# Altium project PCB_Project_2.PrjPcb
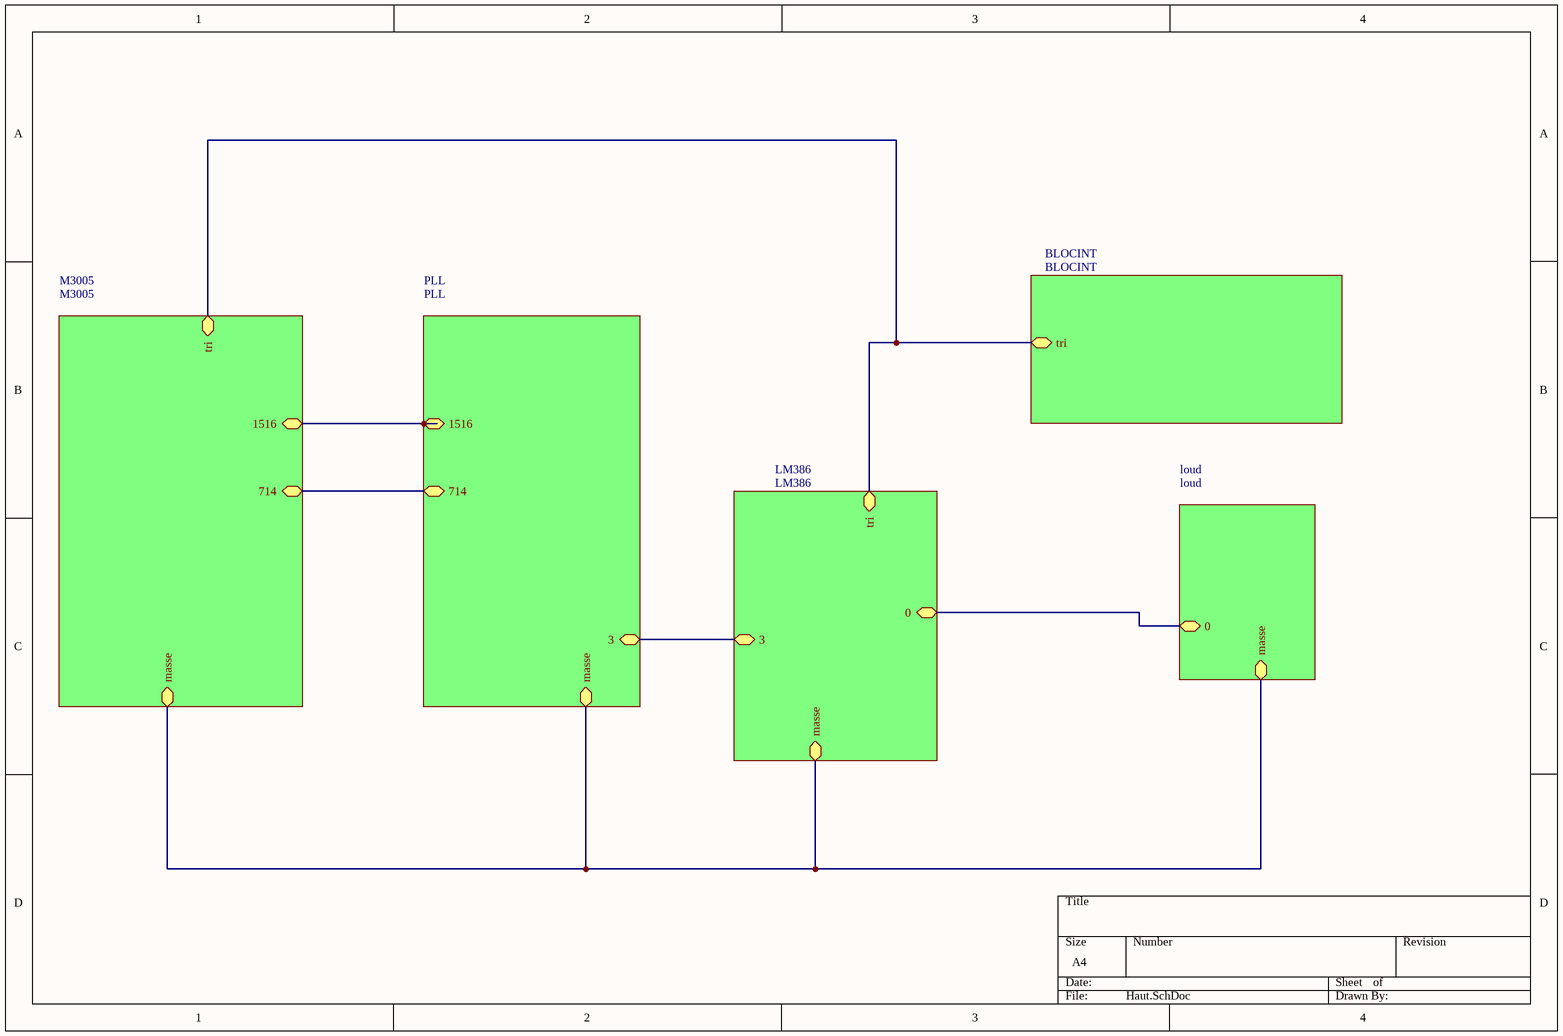
[diagram p0: Haut.SchDoc]
6 sheets, 37 parts. Net scope: hierarchical (ports join the sheet entries above them; power ports are global).
Board files: PCB2.PcbDoc, PCB1.PcbDoc
Sheets:
  Haut.SchDoc
    PLL = PLL.SchDoc
    BLOCINT = BLOCINT.SchDoc
    LM386 = LM386.SchDoc
    loud = loud.SchDoc
    M3005 = M3005.SchDoc

## Sheet Haut.SchDoc
size A4

### Sub-sheets
BLOCINT = BLOCINT: tri
LM386 = LM386: tri, 3, masse, 0
loud = loud: 0, masse
M3005 = M3005: 1516, 714, masse, tri
PLL = PLL: 3, masse, 714, 1516

### Nets
GND: sheet PLL/masse, sheet LM386/masse, sheet loud/masse, sheet M3005/masse
NetC1_1: sheet BLOCINT/tri, sheet LM386/tri, sheet M3005/tri
NetC16_1: sheet PLL/3, sheet LM386/3
NetC19_1: sheet PLL/1516, sheet M3005/1516
NetC20_2: sheet PLL/714, sheet M3005/714
NetLS1_1: sheet LM386/0, sheet loud/0

## Sheet PLL.SchDoc
size A4
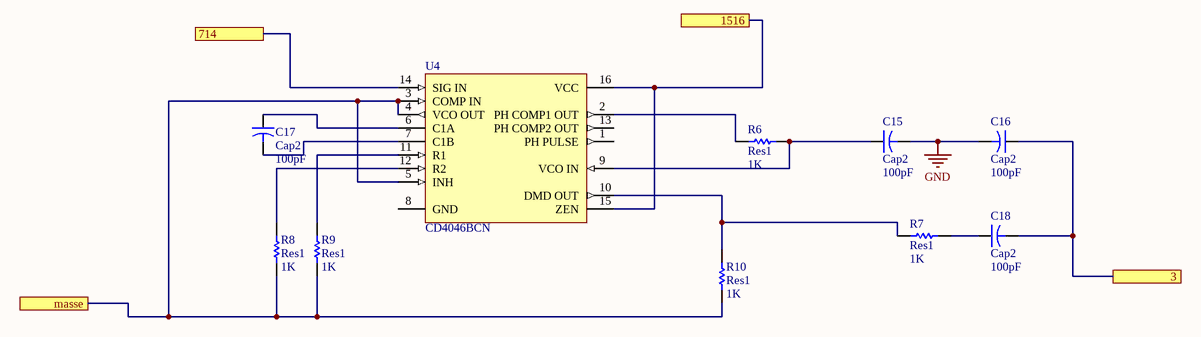
[diagram p1: PLL.SchDoc]

### Parts
C15  Cap2  value 100pF  [RB7.6-15]
C16  Cap2  value 100pF  [RB7.6-15]
C17  Cap2  value 100pF  [RB7.6-15]
C18  Cap2  value 100pF  [RB7.6-15]
R6  Res1  value 1K  [AXIAL-0.3]
R7  Res1  value 1K  [AXIAL-0.3]
R8  Res1  value 1K  [AXIAL-0.3]
R9  Res1  value 1K  [AXIAL-0.3]
R10  Res1  value 1K  [AXIAL-0.3]
U4  CD4046BCN  [N16E]

### Ports
3, 714, 1516, masse

### Nets
GND: C15.2 C16.2 R8.1 R9.1 R10.1 U4.3(COMP_IN) U4.4(VCO_OUT) U4.5(INH) ; port masse
NetC15_1: C15.1 R6.2 U4.9(VCO_IN)
NetC16_1: C16.1 C18.2 ; port 3
NetC17_1: C17.1 U4.6(C1A)
NetC17_2: C17.2 U4.7(C1B)
NetC18_1: C18.1 R7.2
NetC19_1: U4.15(ZEN) U4.16(VCC) ; port 1516
NetC20_2: U4.14(SIG_IN) ; port 714
NetR6_1: R6.1 U4.2(PH_COMP1_OUT)
NetR7_1: R7.1 R10.2 U4.10(DMD_OUT)
NetR8_2: R8.2 U4.12(R2)
NetR9_2: R9.2 U4.11(R1)

Not connected (* = marked no-connect by the designer): U4 1(PH_PULSE) 8(GND) 13(PH_COMP2_OUT)

### Library data of the parts
C15-C18 = Cap2: Capacitor; Published: 23-Sep-2002; PackageReference: CAPR5-4X5; Publisher: Altium Limited; PackageDescription: Capacitor; 2 Leads
R6-R10 = Res1: Resistor; Published: 8-Jun-2000; LatestRevisionDate: 17-Jul-2002; LatestRevisionNote: Re-released for DXP Platform.; PackageReference: AXIAL-0.3; Publisher: Altium Limited; PackageDescription: Axial Device, Thru-Hole; 2 Leads; 0.3 in Pin Spacing
U4 = CD4046BCN: Micropower Phase-Locked Loop; Published: 17-Jul-2002; LatestRevisionDate: 04-Mar-2005; LatestRevisionNote: Stylized 3D Model Added.; DatasheetVersion: Jan-1999; PackageVersion: 2000; PackageReference: N16E; Publisher: Altium Limited; PackageDescription: DIP, 16-Pin, Row Spacing 7.62 mm, Pitch 2.54 mm; ComponentLink1Description: Manufacturer Link; ComponentLink1URL: http://www.fairchildsemi.com/; ComponentLink2Description: Datasheet; ComponentLink2URL: http://www.fairchildsemi.com/ds/CD%2FCD4046BC.pdf

## Sheet BLOCINT.SchDoc
size A4
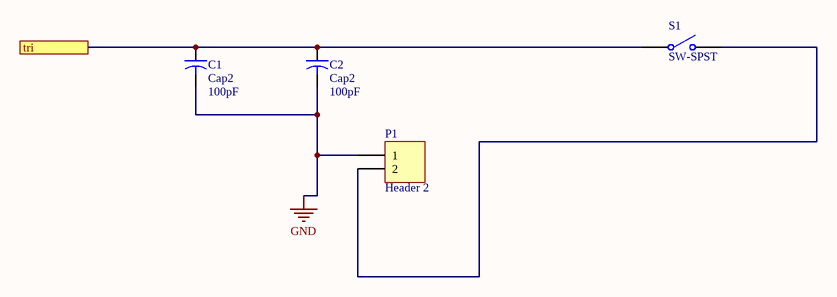
[diagram p2: BLOCINT.SchDoc]

### Parts
C1  Cap2  value 100pF  [RB7.6-15]
C2  Cap2  value 100pF  [RB7.6-15]
P1  Header 2  [HDR1X2]
S1  SW-SPST  [SPST-2]

### Ports
tri

### Nets
GND: C1.2 C2.2 P1.1
NetC1_1: C1.1 C2.1 S1.1(COMMON) ; port tri
NetP1_2: P1.2 S1.2(NO)

### Library data of the parts
C1 C2 = Cap2: Capacitor; Published: 23-Sep-2002; PackageReference: CAPR5-4X5; Publisher: Altium Limited; PackageDescription: Capacitor; 2 Leads
P1 = Header 2: Header, 2-Pin; LatestRevisionDate: 17-Jul-2002; LatestRevisionNote: Re-released for DXP Platform.; Publisher: Altium Limited
S1 = SW-SPST: Single-Pole, Single-Throw Switch; Published: 24-Mar-1999; LatestRevisionDate: 17-Jul-2002; LatestRevisionNote: Re-released for DXP Platform.; PackageReference: SPST-2; Publisher: Altium Limited; PackageDescription: Switch; 2 Leads

## Sheet LM386.SchDoc
size A4
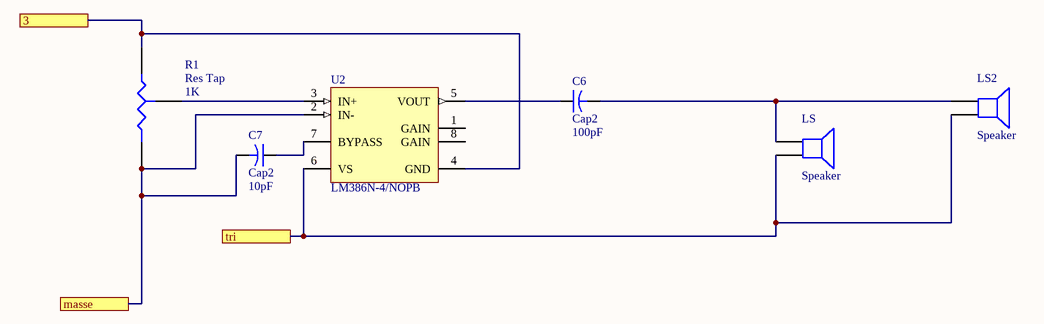
[diagram p3: LM386.SchDoc]

### Parts
(Parts that share a designator on the sheet are numbered #1, #2 ... from top to bottom, then left to right.)
C6  Cap2  value 100pF  [RB7.6-15]
C7  Cap2  value 10pF  [RB7.6-15]
LS  Speaker  [PIN2]
LS2#1  Speaker  [PIN2]
R1  Res Tap  value 1K  [VR3]
U2  LM386N-4/NOPB  [N08E]

### Ports
3, masse, tri

### Nets
GND: C7.2 R1.2(B) U2.2(IN-) ; port masse
NetC1_1: LS.2 LS2#1.2 U2.6(VS) ; port tri
NetC6_1: C6.1 U2.5(VOUT)
NetC6_2: C6.2 LS.1 LS2#1.1
NetC7_1: C7.1 U2.7(BYPASS)
NetC16_1: R1.1(A) U2.4(GND) ; port 3
NetR1_3: R1.3(TAP) U2.3(IN+)

Not connected (* = marked no-connect by the designer): U2 1(GAIN) 8(GAIN)

### Library data of the parts
C6 C7 = Cap2: Capacitor; Published: 23-Sep-2002; PackageReference: CAPR5-4X5; Publisher: Altium Limited; PackageDescription: Capacitor; 2 Leads
LS LS2#1 = Speaker: Loudspeaker; Published: 24-Mar-1999; LatestRevisionDate: 17-Jul-2002; LatestRevisionNote: Re-released for DXP Platform.; PackageReference: PIN2; Publisher: Altium Limited
R1 = Res Tap: Tapped Resistor; Sim Note: Enter the Resistance value and the set point into parameter fields.; Set Position: 0.5; Published: 24-Mar-1999; LatestRevisionDate: 17-Jul-2002; LatestRevisionNote: Re-released for DXP Platform.; PackageReference: VR3; Publisher: Altium Limited; PackageDescription: Variable Resistor, Thru-Hole; 3 Leads
U2 = LM386N-4/NOPB: Low Voltage Audio Power Amplifier, 8-pin MDIP, Pb-Free; Manufacturer: National Semiconductor; PackageTopMarking: NSUZXYTTE#*LM*386N-4; PowerWise: N; CompType: Audio IC; Published: 1-Mar-2010; DatasheetVersion: Aug-2000; PackageVersion: revG, May-2006; PackageReference: N08E; Publisher: Altium Limited; PackageDescription: MDIP, .365 x .250 x .130in, 8 Lead, .100in Pitch; Supplier 1: Digi-Key; Supplier Part Number 1: LM386N-4-ND; Supplier 2: Farnell; Supplier Part Number 2: 1184987; PartNumber: LM386N-4/NOPB; RoHS: Y; PinCount: 8; Code_JEDEC: MS-001-BA; ComponentLink1Description: LM386 Datasheet; ComponentLink1URL: http://www.national.com/ds/LM/LM386.pdf; ComponentLink2Description: LM386 Web Page; ComponentLink2URL: http://www.national.com/pf/LM/LM386.html; ComponentLink3Description: N08E Package Page; ComponentLink3URL: http://www.national.com/packaging/folders/n08e.html

## Sheet loud.SchDoc
size A4
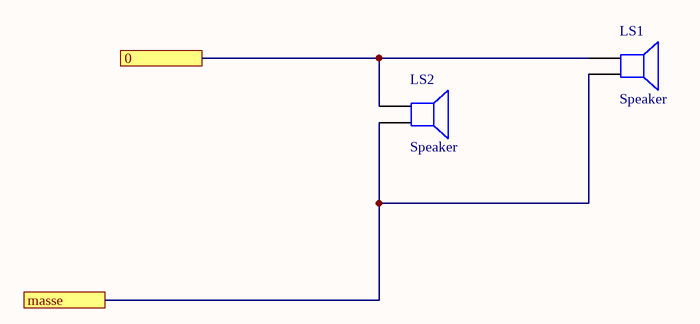
[diagram p4: loud.SchDoc]

### Parts
(Parts that share a designator on the sheet are numbered #1, #2 ... from top to bottom, then left to right.)
LS1  Speaker  [PIN2]
LS2#2  Speaker  [PIN2]

### Ports
0, masse

### Nets
GND: LS1.2 LS2#2.2 ; port masse
NetLS1_1: LS1.1 LS2#2.1 ; port 0

### Library data of the parts
LS1 LS2#2 = Speaker: Loudspeaker; Published: 24-Mar-1999; LatestRevisionDate: 17-Jul-2002; LatestRevisionNote: Re-released for DXP Platform.; PackageReference: PIN2; Publisher: Altium Limited

## Sheet M3005.SchDoc
size A4
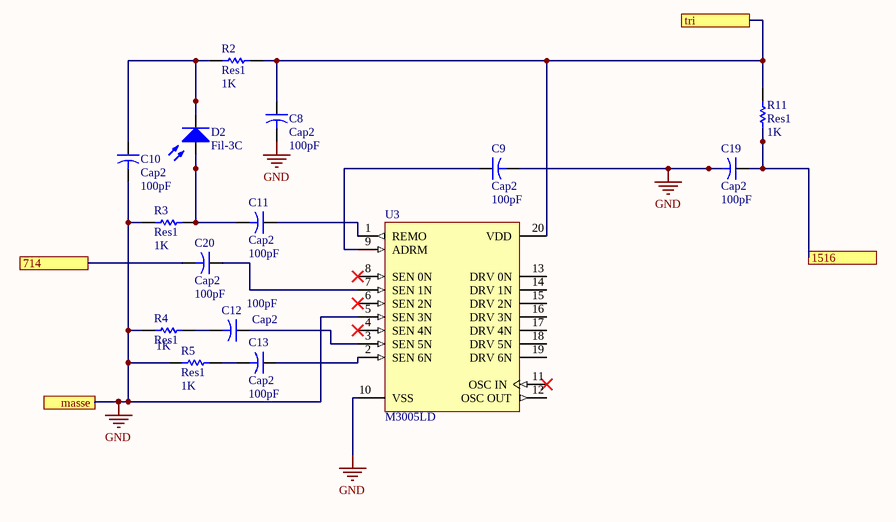
[diagram p5: M3005.SchDoc]

### Parts
C8  Cap2  value 100pF  [RAD-0.2]
C9  Cap2  value 100pF  [RAD-0.2]
C10  Cap2  value 100pF  [RAD-0.2]
C11  Cap2  value 100pF  [RAD-0.2]
C12  Cap2  value 100pF  [RAD-0.2]
C13  Cap2  value 100pF  [RAD-0.2]
C19  Cap2  value 100pF  [RAD-0.2]
C20  Cap2  value 100pF  [RAD-0.2]
D2  Fil-3C  [PIN2]
R2  Res1  value 1K  [AXIAL-0.3]
R3  Res1  value 1K  [AXIAL-0.3]
R4  Res1  value 1K  [AXIAL-0.3]
R5  Res1  value 1K  [AXIAL-0.3]
R11  Res1  value 1K  [AXIAL-0.3]
U3  M3005LD  [SO20_N]

### Ports
714, 1516, masse, tri

### Nets
GND: C8.2 C9.2 C10.2 C19.2 R3.1 R4.1 R5.1 U3.5(SEN_3N) U3.10(VSS) ; port masse
NetC1_1: C8.1 R2.1 R11.2 U3.20(VDD) ; port tri
NetC9_1: C9.1 U3.9(ADRM)
NetC10_1: C10.1 D2.2(K) R2.2
NetC11_1: C11.1 U3.1(REMO)
NetC11_2: C11.2 D2.1(A) R3.2
NetC12_1: C12.1 U3.3(SEN_5N)
NetC12_2: C12.2 R4.2
NetC13_1: C13.1 U3.2(SEN_6N)
NetC13_2: C13.2 R5.2
NetC19_1: C19.1 R11.1 ; port 1516
NetC20_1: C20.1 U3.7(SEN_1N)
NetC20_2: C20.2 ; port 714

Not connected (* = marked no-connect by the designer): U3 4(SEN_4N)* 6(SEN_2N)* 8(SEN_0N)* 11(OSC_IN)* 12(OSC_OUT) 13(DRV_0N) 14(DRV_1N) 15(DRV_2N) 16(DRV_3N) 17(DRV_4N) 18(DRV_5N) 19(DRV_6N)

### Library data of the parts
C8-C13 C19 C20 = Cap2: Capacitor; Published: 23-Sep-2002; PackageReference: CAPR5-4X5; Publisher: Altium Limited; PackageDescription: Capacitor; 2 Leads
D2 = Photo Sen: Photosensitive Diode; Published: 24-Mar-1999; LatestRevisionDate: 17-Jul-2002; LatestRevisionNote: Re-released for DXP Platform.; PackageReference: PIN2; Publisher: Altium Limited
R2-R5 R11 = Res1: Resistor; Published: 8-Jun-2000; LatestRevisionDate: 17-Jul-2002; LatestRevisionNote: Re-released for DXP Platform.; PackageReference: AXIAL-0.3; Publisher: Altium Limited; PackageDescription: Axial Device, Thru-Hole; 2 Leads; 0.3 in Pin Spacing
U3 = M3005LD: Remote Control Transmitter; Published: 24-Aug-2001; LatestRevisionDate: 13-Apr-2006; LatestRevisionNote: IPC-7351 Footprint Added.; DatasheetVersion: Jun-1992; PackageVersion: Jul-2001; PackageReference: SO20; Publisher: Altium Limited; PackageDescription: 20-Pin Plastic Small Outline Integrated Circuit 1.27 mm Pitch; Code_JEDEC: MS-013-AC; Code_IPC: SOIC127P1030-20; ComponentLink1Description: Manufacturer Link; ComponentLink1URL: http://www.st.com/

## Nets that join several sheets
GND: PLL (8 pins), BLOCINT (C1.2 C2.2 P1.1), LM386 (C7.2 R1.2 U2.2), loud (LS1.2 LS2#2.2), M3005 (9 pins)
NetC1_1: BLOCINT (C1.1 C2.1 S1.1), LM386 (LS.2 LS2#1.2 U2.6), M3005 (C8.1 R2.1 R11.2 U3.20)
NetC16_1: PLL (C16.1 C18.2), LM386 (R1.1 U2.4)
NetC19_1: PLL (U4.15 U4.16), M3005 (C19.1 R11.1)
NetC20_2: PLL (U4.14), M3005 (C20.2)